# EAGLE design PiZeroRobotHat (EAGLE 8.3.1)
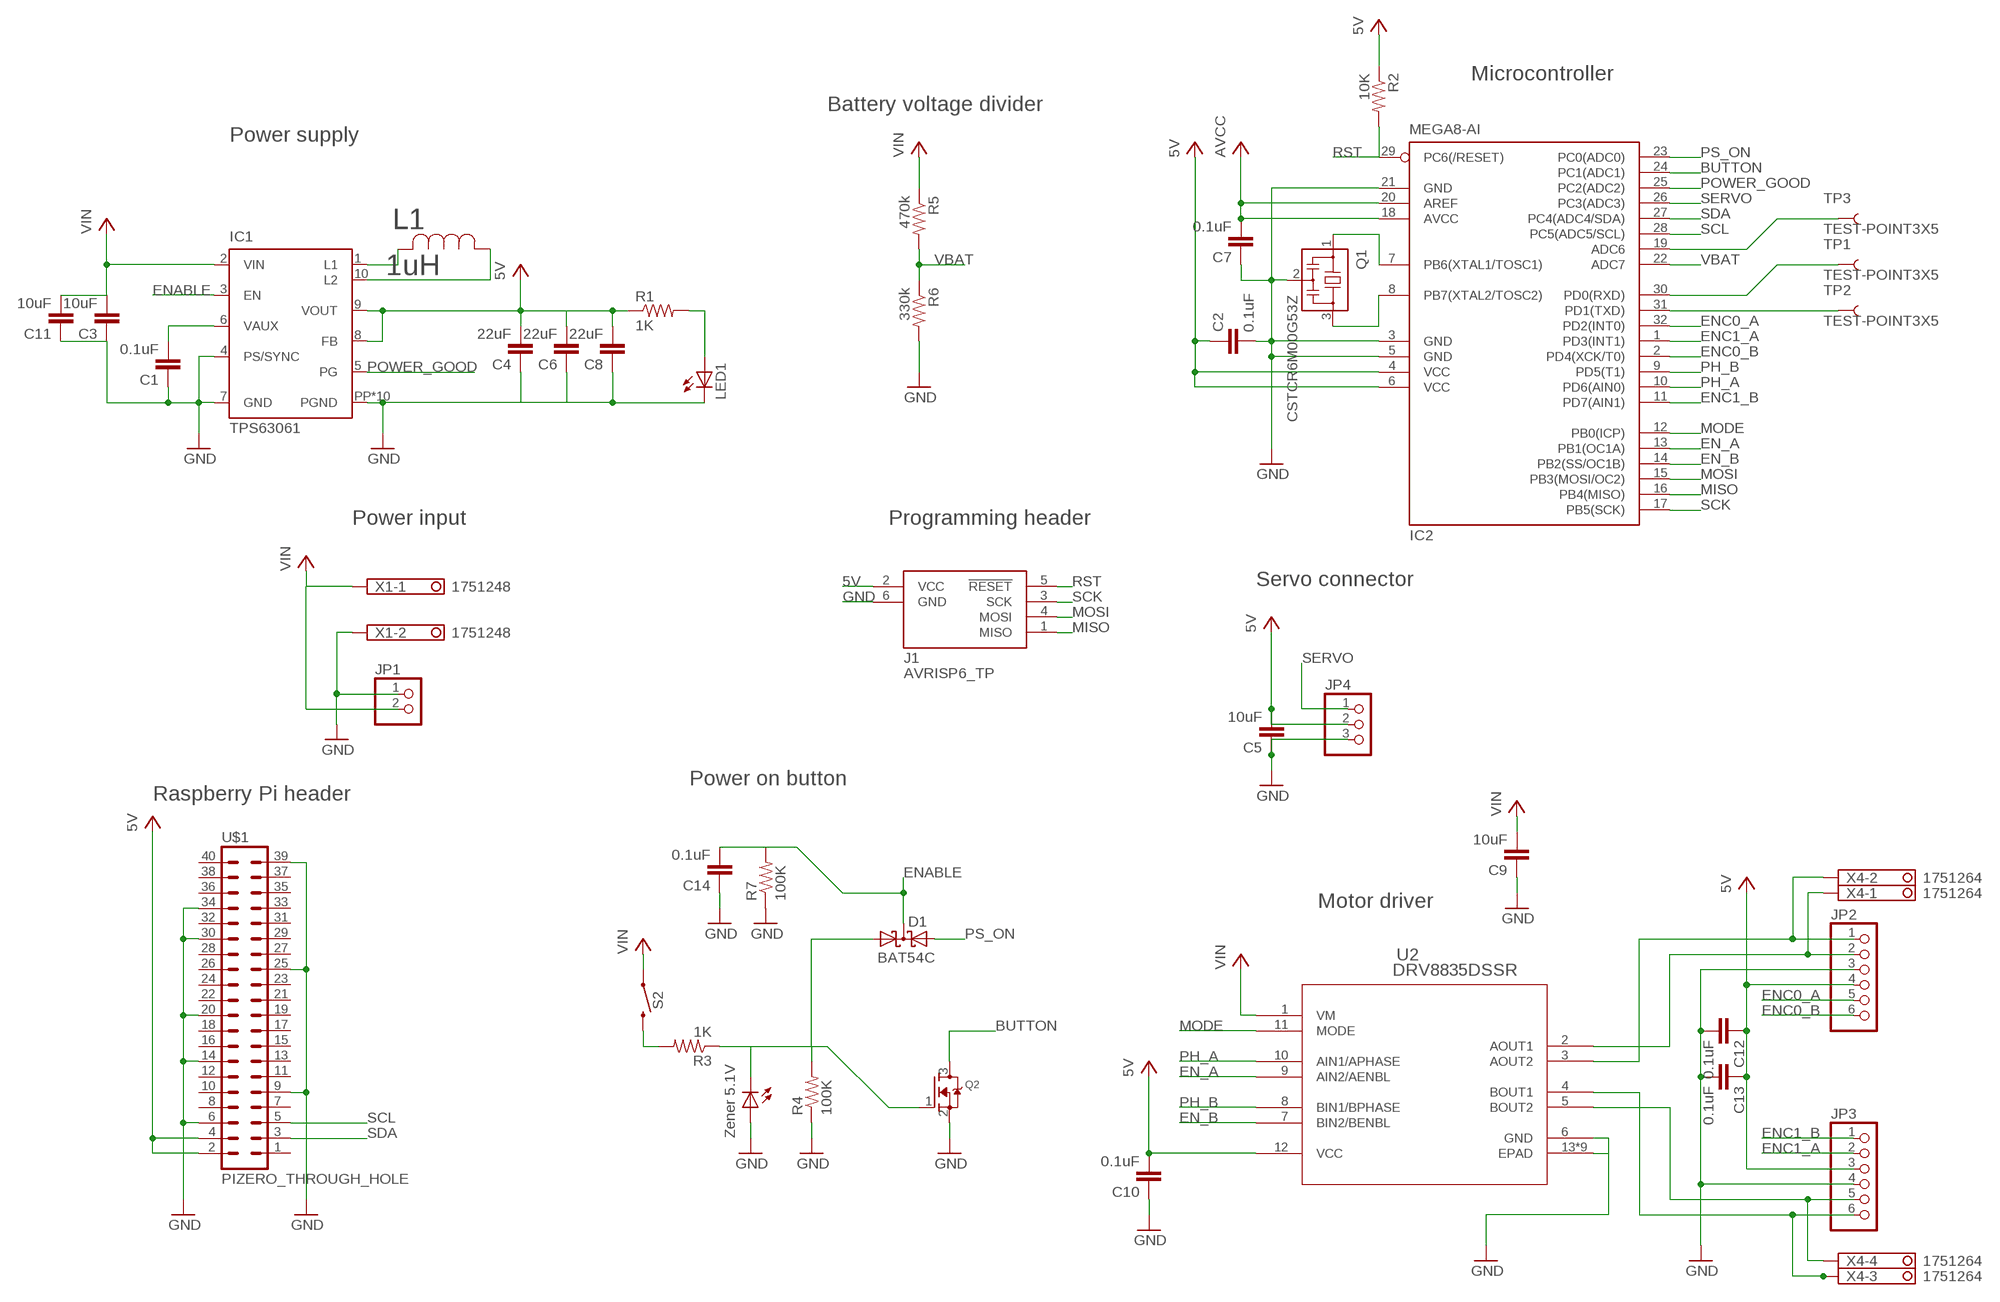
[diagram p0: schematic, sheet 1]

## Parts
C1  0.1uF  C-EUC0603K  [C0603K]
C2  0.1uF  C-EUC0603K  [C0603K]
C3  10uF  C-EUC0805K  [C0805K]
C4  22uF  C-EUC0805K  [C0805K]
C5  10uF  C-EUC0805K  [C0805K]
C6  22uF  C-EUC0805K  [C0805K]
C7  0.1uF  C-EUC0603K  [C0603K]
C8  22uF  C-EUC0805K  [C0805K]
C9  10uF  C-EUC0805K  [C0805K]
C10  0.1uF  C-EUC0603K  [C0603K]
C11  10uF  C-EUC0805K  [C0805K]
C12  0.1uF  C-EUC0603K  [C0603K]
C13  0.1uF  C-EUC0603K  [C0603K]
C14  0.1uF  C-EUC0603K  [C0603K]
D1  BAT54C  [SOT23]
IC1  TPS63061  [DSC-S-PWSON-N10]
IC2  MEGA8-AI  [TQFP32-08]
J1  AVRISP6_TP  [2X3_TP]
JP1  PINHD-1X2  [1X02]
JP2  PINHD-1X6  [1X06]
JP3  PINHD-1X6  [1X06]
JP4  PINHD-1X3  [1X03]
L1  1uH  NR3015T1R0N  [IND_TAIYO_NR3015]
LD1  PL006-WCR12  [SOT23]
LED1  LEDCHIPLED_0603  [CHIPLED_0603]
Q1  CSTCR6M00G53Z  [CSTCR6M]
Q2  MOSFET-NREFLOW  [SOT23]
R1  1K  R-US_R0603  [R0603]
R2  10K  R-US_R0603  [R0603]
R3  1K  R-US_R0603  [R0603]
R4  100K  R-US_R0603  [R0603]
R5  470k  R-US_R0603  [R0603]
R6  330k  R-US_R0603  [R0603]
R7  100K  R-US_R0603  [R0603]
S2  MOMENTARY-SWITCH-SPST  [TACTILE_SWITCH_SMD_4X3MM]
TP1  TEST-POINT3X5  [PAD.03X.05]
TP2  TEST-POINT3X5  [PAD.03X.05]
TP3  TEST-POINT3X5  [PAD.03X.05]
U2  DRV8835DSSR  [DSS12_P9X2]
U$1  PIZERO_THROUGH_HOLE  [PIZERO_THOUGH_HOLE]
X1  1751248  [1751248]
X4  1751264  [1751264]

## Nets
0: IC2.30(PD0(RXD)) TP1.P$1
1: IC2.31(PD1(TXD)) TP2.P$1
5V: C2.1 C4.2 C5.2 C6.2 C7.2 C8.2 C10.2 C12.1 C13.1 IC1.8(FB) IC1.9(VOUT) IC2.4(VCC) IC2.6(VCC) IC2.18(AVCC) IC2.20(AREF) J1.2(VCC) JP2.4 JP3.3 JP4.2 R1.1 R2.1 U2.12(VCC) U$1.2 U$1.4 ; supply symbol labelled AVCC
BT: D1.1(A1) LD1.3(C) Q2.1(G) R3.1 R4.2
BUTTON: IC2.24(PC1(ADC1)) Q2.3(D)
EN_A: IC2.13(PB1(OC1A)) U2.9(AIN2/AENBL)
EN_B: IC2.14(PB2(SS/OC1B)) U2.7(BIN2/BENBL)
ENABLE: C14.2 D1.3(CC) IC1.3(EN) R7.2
ENC0_A: IC2.32(PD2(INT0)) JP2.5
ENC0_B: IC2.2(PD4(XCK/T0)) JP2.6
ENC1_A: IC2.1(PD3(INT1)) JP3.2
ENC1_B: IC2.11(PD7(AIN1)) JP3.1
GND: C1.1 C2.2 C3.1 C4.1 C5.1 C6.1 C7.1 C8.1 C9.1 C10.1 C11.1 C12.2 C13.2 C14.1 IC1.4(PS/SYNC) IC1.7(GND) IC1.PP(PGND) IC1.PP@1(PGND) IC1.PP@2(PGND) IC1.PP@3(PGND) IC1.PP@4(PGND) IC1.PP@5(PGND) IC1.PP@7(PGND) IC1.PP@8(PGND) IC1.PP@9(PGND) IC1.PP@10(PGND) IC2.3(GND) IC2.5(GND) IC2.21(GND) J1.6(GND) JP1.1 JP2.3 JP3.4 JP4.3 LD1.1(A) LED1.C Q1.2 Q2.2(S) R4.1 R6.2 R7.1 U2.6(GND) U2.13(EPAD) U2.14(EPAD) U2.15(EPAD) U2.16(EPAD) U2.17(EPAD) U2.18(EPAD) U2.P$1(EPAD) U2.P$2(EPAD) U2.P$3(EPAD) U$1.6 U$1.9 U$1.14 U$1.20 U$1.25 U$1.30 U$1.34 U$1.39 X1.2
LX1: IC1.1(L1) L1.2
LX2: IC1.10(L2) L1.1
M0A: JP2.1 U2.3(AOUT2) X4.2
M0B: JP2.2 U2.2(AOUT1) X4.1
M1A: JP3.6 U2.4(BOUT1) X4.3
M1B: JP3.5 U2.5(BOUT2) X4.4
MISO: IC2.16(PB4(MISO)) J1.1(MISO)
MODE: IC2.12(PB0(ICP)) U2.11(MODE)
MOSI: IC2.15(PB3(MOSI/OC2)) J1.4(MOSI)
N$1: R3.2 S2.2
N$2: LED1.A R1.2
N$3: C1.2 IC1.6(VAUX)
N$4: IC2.7(PB6(XTAL1/TOSC1)) Q1.1
N$5: IC2.8(PB7(XTAL2/TOSC2)) Q1.3
N$8: IC2.19(ADC6) TP3.P$1
PH_A: IC2.10(PD6(AIN0)) U2.10(AIN1/APHASE)
PH_B: IC2.9(PD5(T1)) U2.8(BIN1/BPHASE)
POWER_GOOD: IC1.5(PG) IC2.25(PC2(ADC2))
PS_ON: D1.2(A2) IC2.23(PC0(ADC0))
RST: IC2.29(PC6(/RESET)) J1.5(!RESET) R2.2
SCK: IC2.17(PB5(SCK)) J1.3(SCK)
SCL: IC2.28(PC5(ADC5/SCL)) U$1.5
SDA: IC2.27(PC4(ADC4/SDA)) U$1.3
SERVO: IC2.26(PC3(ADC3)) JP4.1
VBAT: IC2.22(ADC7) R5.2 R6.1
VIN: C3.2 C9.2 C11.2 IC1.2(VIN) JP1.2 R5.1 S2.1 U2.1(VM) X1.1
Unconnected: U$1.1 U$1.7 U$1.8 U$1.10 U$1.11 U$1.12 U$1.13 U$1.15 U$1.16 U$1.17 U$1.18 U$1.19 U$1.21 U$1.22 U$1.23 U$1.24 U$1.26 U$1.27 U$1.28 U$1.29 U$1.31 U$1.32 U$1.33 U$1.35 U$1.36 U$1.37 U$1.38 U$1.40

## Notes on the sheet
- Microcontroller
- Battery voltage divider
- Power supply
- Power input | Programming header
- Servo connector
- Power on button
- Raspberry Pi header
- Motor driver
- Zener 5.1V

## Library data of the parts
C1-C14 = rcl:C-EU: CAPACITOR, European symbol
D1 = diode:BAT54C: Schottky Diodes Source: Fairchild .. BAT54.pdf
IC1 = texas:TPS6306*: HIGH INPUT VOLTAGE BUCK-BOOST CONVERTER WITH 2A SWITCH CURRENT Source: http://www.ti.com/lit/ds/symlink/tps63060.pdf
IC2 = atmel:MEGA8: MICROCONTROLLER 8 Kbytes FLASH, 1 kbytes SRAM, 512 bytes EEPROM, USART, 6-channel 10 bit ADC, 2-channel 8 bit ADC Pin compatible with Atmega48, ATMega88, ATMega168 Source: avr.lbr; MPN: ATMEGA8-16AU; OC_FARNELL: 9171371; OC_NEWARK: 73M8863
J1 = bt_avr:AVRISP6: 6-pin dual-row connector for Atmel AVRISP programmer interface
JP1 = pinhead:PINHD-1X2: PIN HEADER
JP2 JP3 = pinhead:PINHD-1X6: PIN HEADER
JP4 = pinhead:PINHD-1X3: PIN HEADER
L1 = NR3015T:NR3015T1R0N; MANUFACTURER_PART_NUMBER: NR3015T1R0N; VENDOR: TAIYO YUDEN
LD1 = led:PL006*: PLH006 Series SMD LED SOT23 PLH006-WCR21 Super Red PLH006-WCR12 High Eff Red PLH006-WCG13 Green PLH006-WCY01 Yellow www.p-tec.net Source: http://www.wittig-electronic.de/PTEC/PL006Series.pdf
LED1 = led:LED: LED OSRAM: - CHIPLED LG R971, LG N971, LY N971, LG Q971, LY Q971, LO R971, LY R971 LH N974, LH R974 LS Q976, LO Q976, LY Q976 LO Q996 - Hyper CHIPLED LW Q18S LB Q993, LB Q99A, LB R99A - SideLED LS A670, LO A670, LY A670, LG A670, LP A670 LB A673, LV A673, LT A673, LW A673 LH A674 LY A675 LS A676, LA A676, LO A676, LY A676, LW A676 LS A679, LY A679, LG A679 - Hyper Micro SIDELED® LS Y876, LA Y876, LO Y876, LY Y876 LT Y87S - SmartLED LW L88C, LW L88S LB L89C, LB L89S, LG L890 LS L89K, LO L89K, LY L89K LS L896, LA L896, LO L896, LY L896 - TOPLED LS T670, LO T670, LY T670, LG T670, LP T670 LSG T670, LSP T670, LSY T670, LOP T670, LYG T670 LG T671, LOG T671, LSG T671 LB T673, LV T673, LT T673, LW T673 LH T674 LS T676, LA T676, LO T676, LY T676, LB T676, LH T676, LSB T676, LW T676 LB T67C, LV T67C, LT T67C, LS T67K, LO T67K, LY T67K, LW E67C LS E67B, LA E67B, LO E67B, LY E67B, LB E67C, LV E67C, LT E67C LW T67C LS T679, LY T679, LG T679 LS T770, LO T770, LY T770, LG T770, LP T770 LB T773, LV T773, LT T773, LW T773 LH T774 LS E675, LA E675, LY E675, LS T675 LS T776, LA T776, LO T776, LY T776, LB T776 LHGB T686 LT T68C, LB T68C - Hyper Mini TOPLED® LB M676 - Mini TOPLED Santana® LG M470 LS M47K, LO M47K, LY M47K Source: http://www.osram.convergy.de LUXEON: - LUMILED® LXK2-PW12-R00, LXK2-PW12-S00, LXK2-PW14-U00, LXK2-PW14-V00 LXK2-PM12-R00, LXK2-PM12-S00, LXK2-PM14-U00 LXK2-PE12-Q00, LXK2-PE12-R00, LXK2-PE12-S00, LXK2-PE14-T00, LXK2-PE14-U00 LXK2-PB12-K00, LXK2-PB12-L00, LXK2-PB12-M00, LXK2-PB14-N00, LXK2-PB14-P00, LXK2-PB14-Q00 LXK2-PR12-L00, LXK2-PR12-M00, LXK2-PR14-Q00, LXK2-PR14-R00 LXK2-PD12-Q00, LXK2-PD12-R00, LXK2-PD12-S00 LXK2-PH12-R00, LXK2-PH12-S00 LXK2-PL12-P00, LXK2-PL12-Q00, LXK2-PL12-R00 Source: www.luxeon.com KINGBRIGHT: KA-3528ASYC Source: www.kingbright.com
Q1 = murata-filter:CSTCR: Resonator Source: murata.co.jp; MPN: CSTCR6M00G53-R0; OC_FARNELL: 1170434; OC_NEWARK: 25M8759
Q2 = adafruit:MOSFET-N: N-Channel Mosfet 2N7002E - 60V 260mA SOT23 [Digikey: 2N7002ET1GOSTR-ND] - REEL BSH103 - 30V 850mA SOT23 [Digikey: 568-5013-1-ND]
R1 R5 R6 = rcl:R-US_: RESISTOR, American symbol
R2-R4 R7 = resistor:R-US_: RESISTOR, American symbol
S2 = SparkFun-Switches:MOMENTARY-SWITCH-SPST: Momentary Switch (Pushbutton) - SPST Normally-open (NO) SPST momentary switches (buttons, pushbuttons). Variants PTH-12MM - 12mm square, through-hole Momentary Pushbutton Switch - 12mm Square <https://www.sparkfun.com/products/9190> (COM-09190) PTH-6.0MM, PTH-6.0MM-KIT - 6.0mm square, through-hole Mini Pushbutton Switch <https://www.sparkfun.com/products/97> (COM-00097) KIT package intended for soldering kit's - only one side of pads' copper is exposed. PTH-RIGHT-ANGLE-KIT - Right-angle, through-hole Right Angle Tactile Button <https://www.sparkfun.com/products/10791> - Used on SparkFun BigTime Watch Kit <https://www.sparkfun.com/products/11734> SMD-12MM - 12mm square, surface-mount Tactile Button - SMD (12mm) <https://www.sparkfun.com/products/12993> (COM-12993) Used on SparkFun PicoBoard <https://www.sparkfun.com/products/11888> SMD-4.5MM - 4.5mm Square Trackball Switch Used on SparkFun Blackberry Trackballer Breakout <https://www.sparkfun.com/products/13169> SMD-4.6MMX2.8MM - 4.60mm x 2.80mm, surface mount Used on SparkFun SAMD21 Mini Breakout <https://www.sparkfun.com/products/13664> SMD-5.2MM, SMD-5.2-REDUNDANT - 5.2mm square, surface-mount Mini Pushbutton Switch - SMD <https://www.sparkfun.com/products/8720> (COM-08720) Used on Arduino Pro Mini <https://www.sparkfun.com/products/11114> REDUNDANT package connects both switch circuits together SMD-6.0X3.5MM - 6.0 x 3.5mm, surface mount Momentary Reset Switch SMD <https://www.sparkfun.com/products/8229> (COM-08229) SMD-6.2MM-TALL - 6.2mm square, surface mount Tactile Button - SMD (6mm) <https://www.sparkfun.com/products/12992> Used on SparkFun Digital Sandbox <https://www.sparkfun.com/products/12651> SMD-RIGHT-ANGLE - Right-angle, surface mount Used on SparkFun Block for Intel® Edison - Arduino <https://www.sparkfun.com/products/13036>
TP1-TP3 = SparkFun-Connectors:TEST-POINT: SparkFun Test Points Bare copper test points for troubleshooting or In-Circuit-Testing. These are used by our Production team for verifying production board runs using pogo-pins on test beds. SparkFun Products: SparkFun LSM9DS1 Breakout <https://www.sparkfun.com/products/13284> SparkFun PSOC <https://www.sparkfun.com/products/13714> SparkFun Load Cell Amplifier <https://www.sparkfun.com/products/13879>
U2 = drv8835:DRV8835DSSR; 3D_LIBRARY_NAME: TI_AllParts_20121225; COPYRIGHT: Copyright C 2015 Accelerated Designs. All rights reserved; MANUFACTURER_PART_NUMBER: DRV8835DSSR; VENDOR: Texas Instruments
U$1 = pizero:PIZERO_THROUGH_HOLE
X1 = con-phoenix-350:1751248: MKDS 1/ 2-3,5 Printklemme Nennstrom: 10 A Bemessungsspannung: 160 V Raster: 3,5 mm Polzahl: 2 Montageart: Löten Anschlussart: Schraubanschluss Anschlussrichtung vom Leiter zur Platine: 0° Source: http://eshop.phoenixcontact.com .. 1751248.pdf; OC_FARNELL: unknown; OC_NEWARK: unknown
X4 = con-phoenix-350:1751264: MKDS 1/ 4-3,5 Printklemme Nennstrom: 10 A Bemessungsspannung: 160 V Raster: 3,5 mm Polzahl: 4 Montageart: Löten Anschlussart: Schraubanschluss Anschlussrichtung vom Leiter zur Platine: 0° Source: http://eshop.phoenixcontact.com .. 1751264.pdf; MPN: 1751264; OC_FARNELL: unknown; OC_NEWARK: 10R0934

## Board
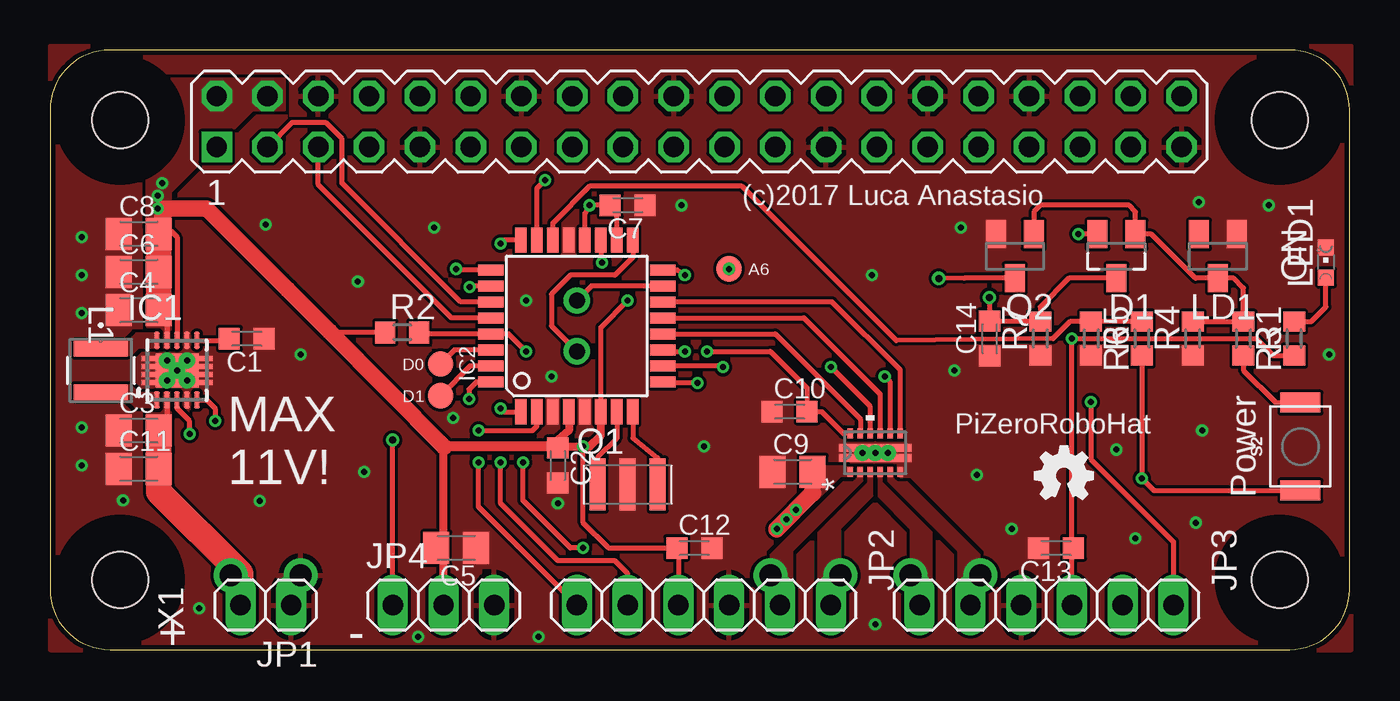
[diagram p1: board, top side]
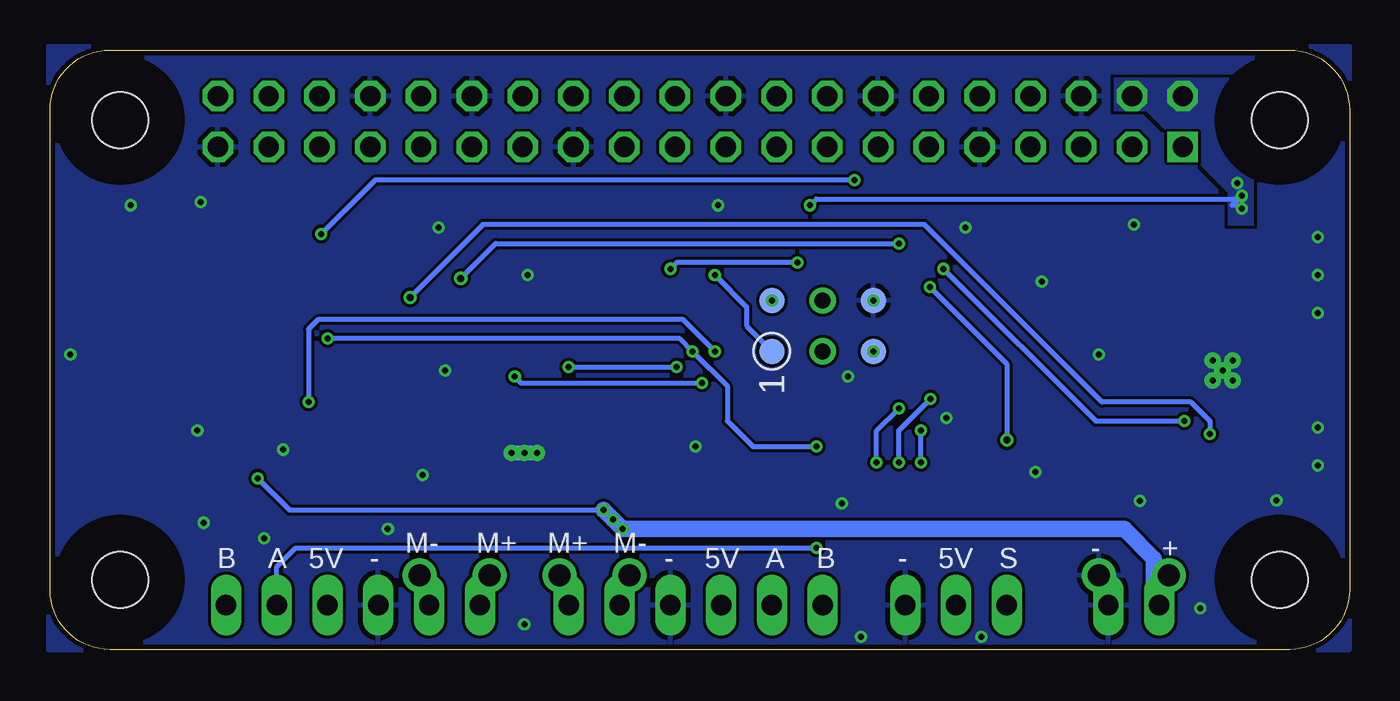
[diagram p2: board, bottom side, seen from below]

Size 65 x 30 mm. Coordinates in mm from the lower left corner, seen from the top.
Copper layers (1*16): Top 0.035mm / dielectric 1.5mm / Bottom 0.035mm
Design rules "SeeedStudio_2layer_DRU_no_angle_20140221": minimum track width 6mil, minimum drill 12mil, track to track 6mil, track to pad 6mil, pad to pad 6mil, via to via 6mil, smd to smd 0mil, copper to edge 10mil, drill to drill 10mil, minimum pad ring 10mil, minimum via ring 6mil, stop-mask expansion 2mil, vias tented up to drill 100mil, thermal gap 10mil

### Footprints (pad centres in the part's own frame; a part is rotated, then mirrored left to right if it is on the bottom)
C0603K = smd 1.05 x 1.08: 1 -0.875,0; 2 0.875,0
C0805K = smd 1.3 x 1.6: 1 -1,0; 2 1,0
SOT23 = smd 1 x 1.4: 1 -0.95,-1.1; 2 0.95,-1.1; 3 0,1.1
DSC-S-PWSON-N10 = smd 0.28 x 0.85: 1 -1,-1.488; 2 -0.5,-1.488; 3 0,-1.488; 4 0.5,-1.488; 5 1,-1.488; 6 1,1.5; 7 0.5,1.5; 8 0,1.5; 9 -0.5,1.5; 10 -1,1.5 | smd 2.15 x 1.7: PP 0,0 | smd 3.55 x 0.25: PP@1 0,0.6; PP@2 0,0.2; PP@3 0,-0.2; PP@4 0,-0.6 | drill 0.3 pad 0.4: PP@5 -0.5,0.5; PP@7 0,0; PP@8 0.5,0.5; PP@9 -0.5,-0.5; PP@10 0.5,-0.5
TQFP32-08 = smd 1.27 x 0.559: 1 -4.293,2.8; 2 -4.293,2; 3 -4.293,1.2; 4 -4.293,0.4; 5 -4.293,-0.4; 6 -4.293,-1.2; 7 -4.293,-2; 8 -4.293,-2.8; 17 4.293,-2.8; 18 4.293,-2; 19 4.293,-1.2; 20 4.293,-0.4; 21 4.293,0.4; 22 4.293,1.2; 23 4.293,2; 24 4.293,2.8 | smd 0.559 x 1.27: 9 -2.8,-4.293; 10 -2,-4.293; 11 -1.2,-4.293; 12 -0.4,-4.293; 13 0.4,-4.293; 14 1.2,-4.293; 15 2,-4.293; 16 2.8,-4.293; 25 2.8,4.293; 26 2,4.293; 27 1.2,4.293; 28 0.4,4.293; 29 -0.4,4.293; 30 -1.2,4.293; 31 -2,4.293; 32 -2.8,4.293
2X3_TP = smd 1.27 x 1.27: 1 -1.27,2.54; 2 1.27,2.54; 5 -1.27,-2.54; 6 1.27,-2.54 | drill 0.8: 3 -1.27,0; 4 1.27,0
1X02 = drill 1.016 long: 1 -1.27,0; 2 1.27,0
1X06 = drill 1.016 long: 1 -6.35,0; 2 -3.81,0; 3 -1.27,0; 4 1.27,0; 5 3.81,0; 6 6.35,0
1X03 = drill 1.016 long: 1 -2.54,0; 2 0,0; 3 2.54,0
IND_TAIYO_NR3015 = smd 0.8 x 2.692: 1 -1.099,0; 2 1.099,0
CHIPLED_0603 = smd 0.8 x 0.8: A 0,-0.75; C 0,0.75
CSTCR6M = smd 0.8 x 2.6: 1 -1.5,0; 2 0,0; 3 1.5,0
R0603 = smd 1 x 1.1: 1 -0.85,0; 2 0.85,0
TACTILE_SWITCH_SMD_4X3MM = smd 1 x 2: 1 -2.2,0; 2 2.2,0
PAD.03X.05 = smd 1.27 x 1.27: P$1 0,0
DSS12_P9X2 = smd 0.5 x 0.28: 1 -0.959,1.25; 2 -0.959,0.75; 3 -0.959,0.25; 4 -0.959,-0.25; 5 -0.959,-0.75; 6 -0.959,-1.25; 7 0.959,-1.25; 8 0.959,-0.75; 9 0.959,-0.25; 10 0.959,0.25; 11 0.959,0.75; 12 0.959,1.25 | smd 0.9 x 2: 13 0,0 | smd 0.406 x 0.813: 14 -0.254,-1.397; 15 0.254,-1.397; 16 -0.254,1.397; 17 0.254,1.397 | smd 0.711 x 1.981 bottom: 18 0,0 | drill 0.3 pad 0.61: P$1 0,0; P$2 0,0.635; P$3 0,-0.635
PIZERO_THOUGH_HOLE = drill 1.016 square: 1 8.34,25.15 | drill 1.016 octagon: 2 8.34,27.69; 3 10.88,25.15; 4 10.88,27.69; 5 13.42,25.15; 6 13.42,27.69; 7 15.96,25.15; 8 15.96,27.69; 9 18.5,25.15; 10 18.5,27.69; 11 21.04,25.15; 12 21.04,27.69; 13 23.58,25.15; 14 23.58,27.69; 15 26.12,25.15; 16 26.12,27.69; 17 28.66,25.15; 18 28.66,27.69; 19 31.2,25.15; 20 31.2,27.69; 21 33.74,25.15; 22 33.74,27.69; 23 36.28,25.15; 24 36.28,27.69; 25 38.82,25.15; 26 38.82,27.69; 27 41.36,25.15; 28 41.36,27.69; 29 43.9,25.15; 30 43.9,27.69; 31 46.44,25.15; 32 46.44,27.69; 33 48.98,25.15; 34 48.98,27.69; 35 51.52,25.15; 36 51.52,27.69; 37 54.06,25.15; 38 54.06,27.69; 39 56.6,25.15; 40 56.6,27.69 | hole 2.8: 3.5,3.5; 3.5,26.5; 61.5,26.5; 61.5,3.5
1751248 = drill 1.1 pad 1.7: 1 -1.75,-0.1; 2 1.75,-0.1
1751264 = drill 1.1 pad 1.7: 1 -5.25,-0.1; 2 -1.75,-0.1; 3 1.75,-0.1; 4 5.25,-0.1

### Placement (x,y rotation side)
C1  9.84,15.56 180 top
C2  25.4,9.21 270 top
C3  4.45,10.95 0 top
C4  4.45,16.99 0 top
C5  20.32,5.08 180 top
C6  4.45,18.89 0 top
C7  28.89,22.23 180 top
C8  4.45,20.8 0 top
C9  37.15,8.89 0 top
C10  36.99,11.91 0 top
C11  4.45,9.05 0 top
C12  32.23,5.08 0 top
C13  50.32,5.08 180 top
C14  46.99,15.56 90 top
D1  53.34,19.68 180 top
IC1  6.35,13.97 0 top
IC2  26.35,16.19 90 top
J1  26.35,16.19 90 bottom
JP1  10.79,2.22 180 top
JP2  32.7,2.22 180 top
JP3  49.85,2.22 180 top
JP4  19.68,2.22 0 top
L1  2.54,13.97 270 top
LD1  58.42,19.68 180 top
LED1  63.82,19.37 0 top
Q1  28.89,8.26 0 top
Q2  48.26,19.68 180 top
R1  62.23,15.56 90 top
R2  17.62,15.88 0 top
R3  59.69,15.56 270 top
R4  57.15,15.56 90 top
R5  54.61,15.56 90 top
R6  52.07,15.56 270 top
R7  49.53,15.56 90 top
S2  62.55,10.16 90 top
TP1  19.53,14.29 0 top
TP2  19.53,12.7 0 top
TP3  33.97,19.05 0 top
U2  41.27,9.84 90 top
U$1  0,0 0 top
X1  10.79,3.81 0 top
X4  41.27,3.81 0 top

### Tracks (layer width: path | path; a pad name or v marks a point on that pad's centre or on a via)
0
  Top 0.254: IC2.30 20.23,14.99 TP1.P$1
1
  Top 0.254: IC2.31 21.02,14.19 TP2.P$1
5V  (via drill 0.3 pad 0.41)
  Top 0.254: 5.71,22.07 5.71,20.95 6.03,20.95 6.35,20.64 IC1.8 | IC2.6 27.55,16.12 J1.2 | IC2.18 28.35,22.13 27.94,22.23 | 27.94,22.23 v26.99,22.23 26.75,21.82 IC2.20 | C7.2 28.34,22.15 27.94,22.23 | JP2.4 31.43,5 C12.1 27.94,5.08 26.67,6.35 v26.67,10.16 | JP3.3 51.12,4.92 51.2,5 C13.1 51.2,5.16 51.12,5.24 v51.12,15.56 60.33,15.56 61.17,14.71 R1.1 | 11.91,17.94 11.97,17.94 11.89,18.01 | R2.1 14.01,15.88 13.98,15.91 | v32.86,14.92 36.04,14.92 37.86,13.1 C10.2 38.58,11.91 39.68,10.8 U2.12
  Top 0.28: IC1.9 5.85,16.42 C4.2
  Top 0.406: IC2.6 27.55,10.72 26.99,10.16 v26.67,10.16 25.4,10.16 C2.1 25.4,10.48 25.95,10.95 IC2.4 | JP4.2 19.68,4.76 | 19.68,4.76 C5.2 19.64,4.76 19.68,4.76 | 19.68,4.76 19.7,5.06 19.68,5.08 19.68,10.16 19.72,10.14
  Top 0.508: C2.1 25.16,10.16 19.73,10.16 19.72,10.14
  Top 0.813: C8.2 5.71,22.07 7.83,22.07 11.89,18.01 13.98,15.91 19.72,10.14
  Top 1.27: C8.2 C6.2 C4.2
  Bottom 0.254: v51.12,15.56 33.5,15.56 v32.86,14.92 31.11,13.18 31.11,11.43 29.84,10.16 v26.67,10.16 | v26.99,22.23 26.67,22.54 5.71,22.54 5.71,22.23 5.87,22.23 v5.4,22.7
  other vias: 28.89,17.46 5.4,22.07 5.62,23.34
  pour Top (isolate 0.127, no thermals): 6.03,21.27 6.03,22.86 10.16,26.99 11.75,26.99 11.75,28.57 4.83,28.57 4.83,21.27
  pour Bottom (isolate 0.127, no thermals): 6.03,21.27 6.03,22.86 10.16,26.99 11.75,26.99 11.75,28.57 4.83,28.57 4.83,21.27
  pour Top (isolate 0.152, no thermals): 5.71,15.05 5.97,15.05 5.97,15.94 6.03,16 6.03,16.26 4.86,16.26 4.86,16.13 5.52,16.13 5.71,15.94
BT
  Top 0.254: R4.2 R3.1 59.69,18.1 59.2,18.59 LD1.3 57.3,18.59 55.1,20.79 D1.1 54.29,21.91 53.98,22.23 49.53,22.23 49.21,21.91 Q2.1
BUTTON  (via drill 0.3, 0.35)
  Top 0.254: IC2.24 22.7,20.48 v22.54,20.32 | Q2.3 45.73,18.59 v44.45,18.57
  Bottom 0.254: v44.45,18.57 42.7,20.32 v22.54,20.32
EN_A
  Top 0.254: IC2.13 37.7,16.59 41.52,12.77 U2.9
EN_B
  Top 0.254: IC2.14 39.12,17.39 42.52,13.99 U2.7
ENABLE  (via drill 0.3, 0.35)
  Top 0.254: v6.99,10.79 6.99,11.43 6.35,12.06 IC1.3 | v46.99,17.62 C14.2 49.51,16.43 R7.2 49.53,17.14 50.97,18.59 D1.3
  Bottom 0.254: v6.99,10.79 6.99,11.43 7.94,12.38 12.38,12.38 21.27,21.27 43.34,21.27 v46.99,17.62
ENC0_A  (via drill 0.3 pad 0.41)
  Top 0.254: JP2.5 28.89,3.81 28.26,4.45 25.4,4.45 22.54,7.3 v22.54,9.37 | IC2.32 21.33,13.39 20.95,13.02 v20.95,12.54
  Bottom 0.254: v22.54,9.37 22.54,10.95 v20.95,12.54
ENC0_B  (via drill 0.3 pad 0.41)
  Top 0.254: JP2.6 21.43,7.14 v21.43,9.37 | v21.43,10.95 24.13,10.95 24.35,11.18 IC2.2
  Bottom 0.254: v21.43,9.37 v21.43,10.95
ENC1_A  (via drill 0.3)
  Top 0.254: v26.67,5.08 26.04,5.08 23.65,7.46 v23.65,9.37 | v22.54,12.06 22.7,11.9 IC2.1
  Bottom 0.254: JP3.2 53.66,4.13 52.7,5.08 v26.67,5.08 | v23.65,9.37 23.65,10.95 v22.54,12.06
ENC1_B  (via drill 0.3 pad 0.41)
  Top 0.254: IC2.11 30.71,14.92 v31.75,14.92 | v52.07,12.38 52.07,9.53 56.2,5.4 JP3.1
  Bottom 0.254: v31.75,14.92 33.34,16.51 51.59,16.51 52.07,16.03 v52.07,12.38
GND  (via drill 0.3 pad 0.41)
  other vias: 31.59,22.23 45.24,13.97 15.72,8.89 48.1,6.03 53.34,10 1.59,16.83 1.59,18.73 1.59,20.64 1.59,11.11 1.59,9.21 3.65,7.46 7.46,2.06 18.41,0.64 24.45,0.64 41.27,1.27 54.29,5.56 19.21,21.11 60.96,22.23 41.12,18.73 57.31,6.35 32.7,10.16 12.54,14.76 10.79,21.27 57.47,22.38 23.81,17.46 10.48,7.43 20.16,11.59 15.4,18.41 25.4,7.3 25.08,13.65 57.63,10.95 63.98,14.76 45.56,21.11 46.35,8.73
  pour Top (isolate 0.127, rank 2): 0,0 65.09,0 65.09,30.16 0,30.16
  pour Bottom (isolate 0.127, rank 2): 0,30.16 65.09,30.16 65.09,0 0,0
  pour Top (isolate 0.127, rank 2, no thermals): 0.32,23.81 64.77,23.81 64.77,4.13 16.19,4.13 14.61,5.71 0.32,5.71
  pour Bottom (isolate 0.254, no thermals): 4.76,15.56 4.76,12.38 7.94,12.38 7.94,15.56
LX1
  pour Top (isolate 0.152, no thermals): 5.27,12.83 4.45,12.83 4.06,13.21 3.81,13.21 3.81,12.57 4.25,12.13 5.27,12.13
LX2
  pour Top (isolate 0.152, no thermals): 5.27,15.81 4.32,15.81 3.87,15.37 3.87,14.73 4.06,14.73 4.45,15.11 5.27,15.11
M0A
  Top 0.28: 38.73,3.23 JP2.1
  pour Top (isolate 0.127, no thermals): 41.15,9.11 41.15,7.65 39.53,6.03 39.53,3.02 38.42,3.02 38.42,5.87 40.9,8.36 40.9,9.11
M0B
  pour Top (isolate 0.127, no thermals): 40.64,9.11 40.64,8.41 37.15,4.92 37.15,3.02 36.04,3.02 36.04,4.76 39.69,8.41 40.19,8.41 40.4,8.62 40.4,9.11
M1A
  Top 0.28: 43.81,3.23 JP3.6
  pour Top (isolate 0.127, no thermals): 41.4,9.11 41.4,7.65 43.02,6.03 43.02,3.02 44.13,3.02 44.13,5.87 41.65,8.36 41.65,9.11
M1B
  Top 0.28: 46.35,3.23 JP3.5
  pour Top (isolate 0.127, no thermals): 41.91,9.11 42.15,9.11 42.15,8.62 42.36,8.41 42.86,8.41 46.51,4.76 46.51,3.02 45.4,3.02 45.4,4.92 41.91,8.41
MISO  (via drill 0.3 pad 0.41)
  Top 0.254: IC2.16 31.38,18.99 v31.75,18.73
  Bottom 0.254: v31.75,18.73 30.16,17.14 30.16,16.19 J1.1
MODE
  Top 0.254: U2.11 40.52,11.54 36.28,15.79 IC2.12
MOSI
  Top 0.254: IC2.15 27.08,18.19 J1.4
N$1
  Top 0.254: R3.2 59.69,13.97 61.28,12.38 S2.2
N$2
  Top 0.254: R1.2 63.08,16.41 63.82,17.14 LED1.A
N$3
  Top 0.254: IC1.6 9.2,15.47 C1.2
N$4
  Top 0.254: IC2.7 28.35,10.57 27.39,9.61 Q1.1
N$5
  Top 0.254: IC2.8 29.15,10.58 30.39,9.6 Q1.3
N$8  (via drill 0.3)
  Top 0.254: IC2.19 27.55,19.44 v27.62,19.37
  Bottom 0.254: v27.62,19.37 33.66,19.37 TP3.P$1
  other vias: 33.97,19.05
PH_A  (via drill 0.3 pad 0.41)
  Top 0.254: v39.05,14.13 41.02,12.16 U2.10 | v33.66,14.13 33.56,14.19 IC2.10
  Bottom 0.254: v39.05,14.13 v33.66,14.13
PH_B  (via drill 0.3 pad 0.41)
  Top 0.254: v32.38,13.34 30.7,13.34 IC2.9 | v41.75,13.65 42.02,13.38 U2.8
  Bottom 0.254: v41.75,13.65 41.43,13.34 v32.38,13.34
POWER_GOOD  (via drill 0.3 pad 0.41)
  Top 0.254: IC2.25 20.38,18.99 v20.32,19.05 | IC1.5 7.84,12.48 8.26,12.06 v8.26,11.43
  Bottom 0.254: v20.32,19.05 12.7,11.43 v8.26,11.43
PS_ON  (via drill 0.3)
  Top 0.254: IC2.23 24.35,23.08 v24.77,23.5 | D1.2 v51.44,20.8
  Bottom 0.254: v24.77,23.5 48.74,23.5 v51.44,20.8
RST  (via drill 0.3 pad 0.41)
  Top 0.254: J1.5 22.94,15.79 IC2.29 18.24,15.79 R2.2
  other vias: 23.81,14.92
SCK
  Top 0.254: IC2.17 29.15,19.63 28.26,18.73 26.04,18.73 25.08,17.78 25.08,16.19 J1.3
SCL
  Top 0.254: IC2.28 20.08,16.59 13.42,23.25 U$1.5
SDA
  Top 0.254: IC2.27 20.55,17.39 14.61,23.34 14.61,25.56 13.81,26.35 12.08,26.35 U$1.3
SERVO  (via drill 0.3, 0.35)
  Top 0.254: JP4.1 v17.14,10.48 | IC2.26 21.05,18.19 v20.99,18.13
  Bottom 0.254: v20.99,18.13 17.14,14.29 v17.14,10.48
VBAT
  Top 0.254: IC2.22 25.15,21.34 26.99,23.18 34.61,23.18 42.33,15.46 50.16,15.56 51.02,16.41 R6.1 R5.2
VIN  (via drill 0.3 pad 0.41)
  Top 0.152: X1.1 9.68,2.7 JP1.2
  Top 0.254: R5.1 v54.61,8.57 55.22,7.96 S2.1
  Top 0.28: IC1.2 5.85,11.52 C3.2
  Top 0.6: v37.31,6.99 v36.35,6.03
  Top 0.813: C11.2 5.45,9.2 | 38.15,7.83 C9.2
  Top 0.838: v36.35,6.03 38.15,7.83
  Top 1.27: JP1.2 9.53,3.81 5.45,7.89 5.45,9.2 C3.2
  Bottom 0.254: v54.61,8.57 53.02,6.99 v37.31,6.99
  Bottom 0.813: v37.31,6.99 v36.83,6.51 v36.35,6.03 11.27,6.03 9.78,4.54 9.78,2.67 9.53,2.41 JP1.2
  pour Top (isolate 0.127, no thermals): 40.14,9.12 40.14,8.65 39.55,8.65 38.35,7.45 37.62,8.55 37.62,9.23 39.78,9.22 39.88,9.12
  pour Top (isolate 0.152, no thermals): 5.71,12.89 5.97,12.89 5.97,11.94 6.03,11.87 6.03,11.68 4.86,11.68 4.86,11.81 5.52,11.81 5.71,12

### Text on the board
tPlace: (c)2017 Luca Anastasio | A6 | ON | D0 | D1 | PiZeroRoboHat | MAX / 11V! | Power | + | -
bPlace: + | - | M- | M+ | M+ | M- | S | 5V | - | B | A | 5V | - | - | 5V | A | B